# EAGLE design max10adc_v9.02_16chan_frontpanel (EAGLE 9.5.2)
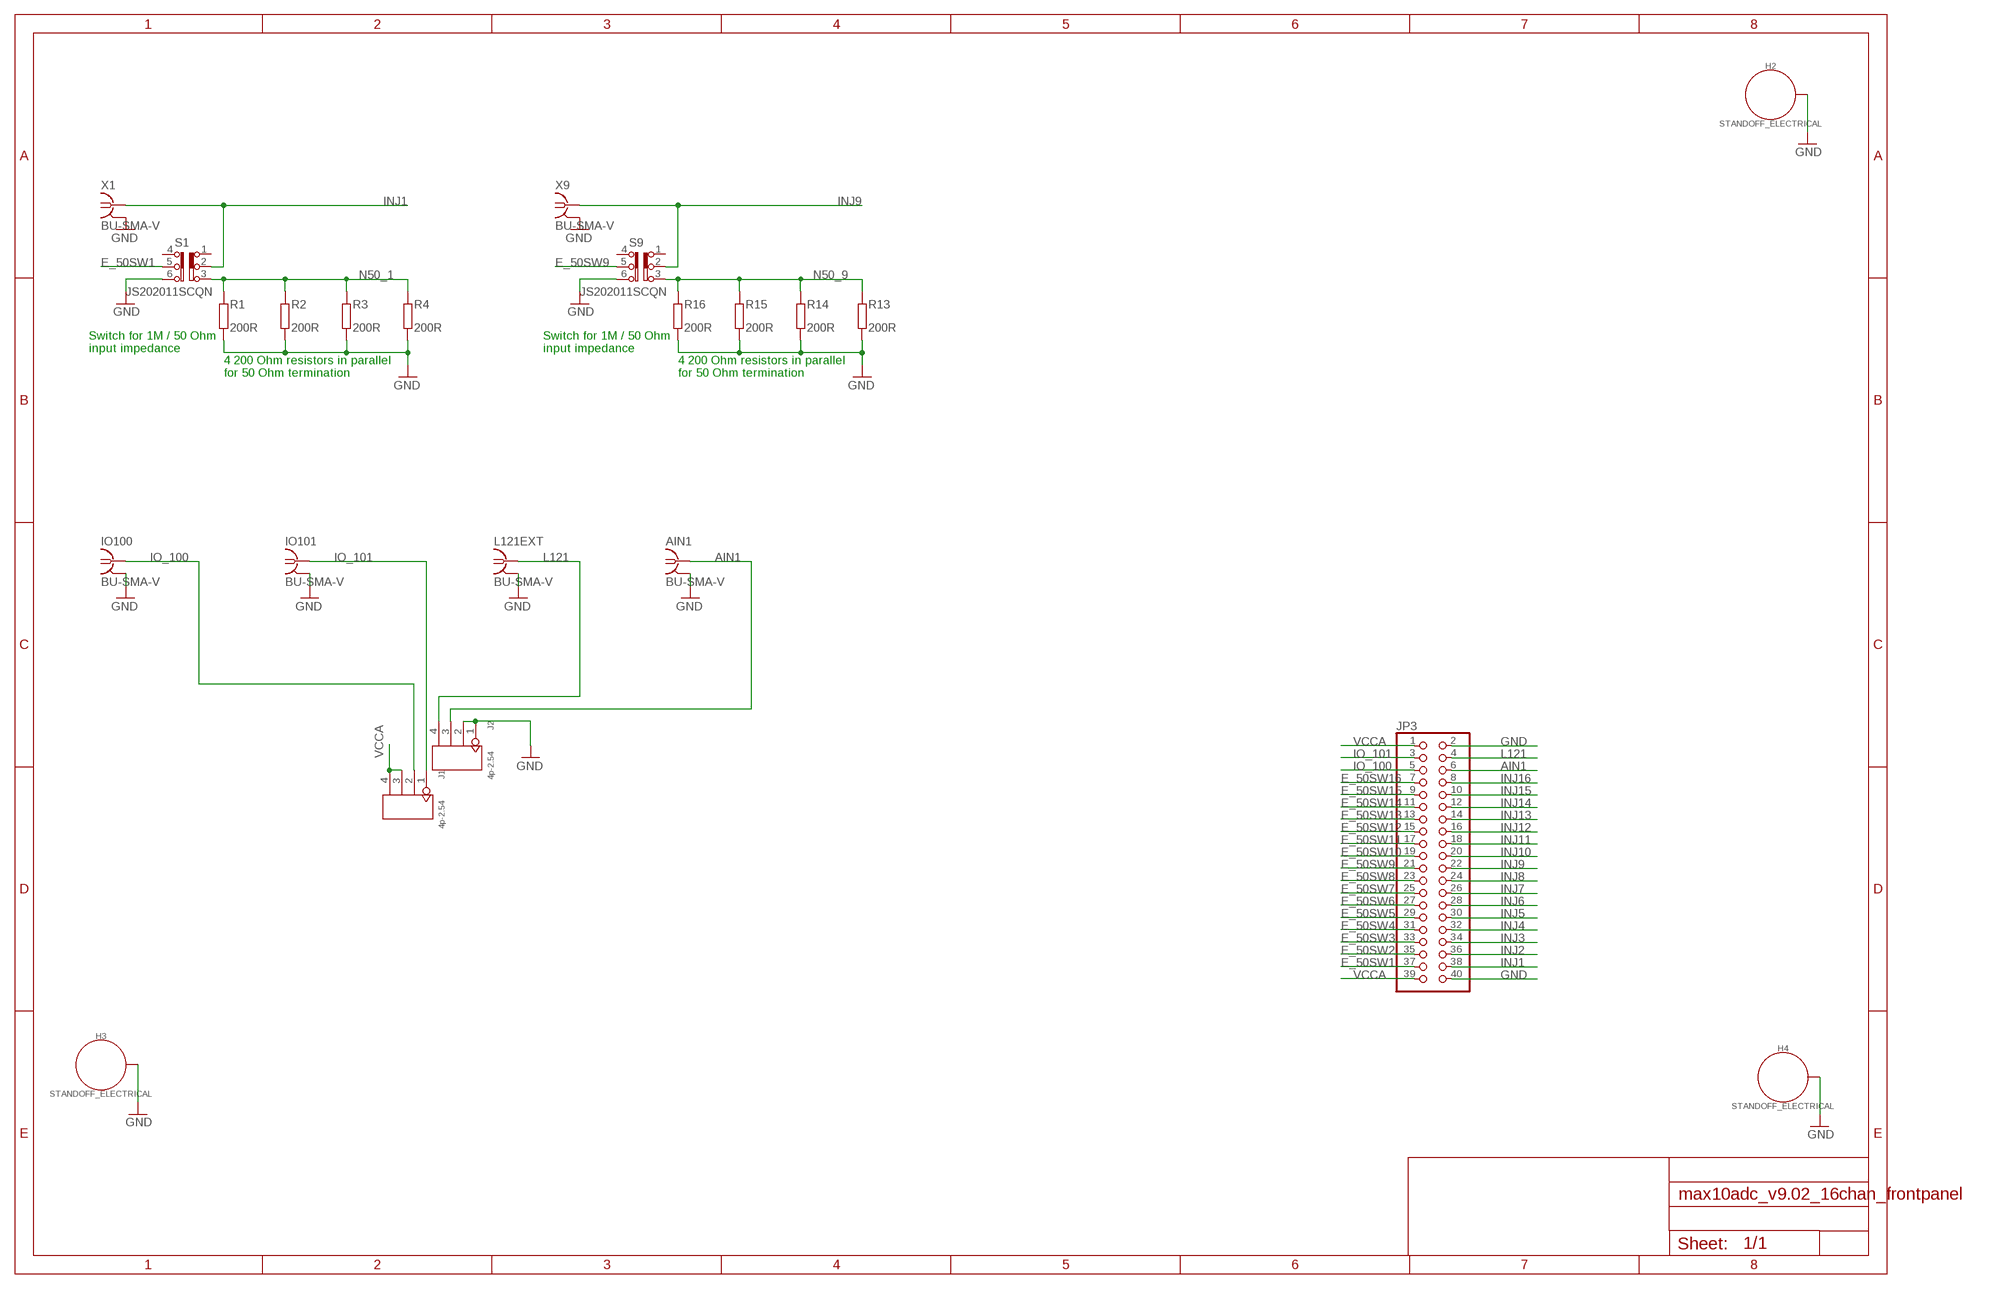
[diagram p0: schematic, sheet 1, part 1 of 2]
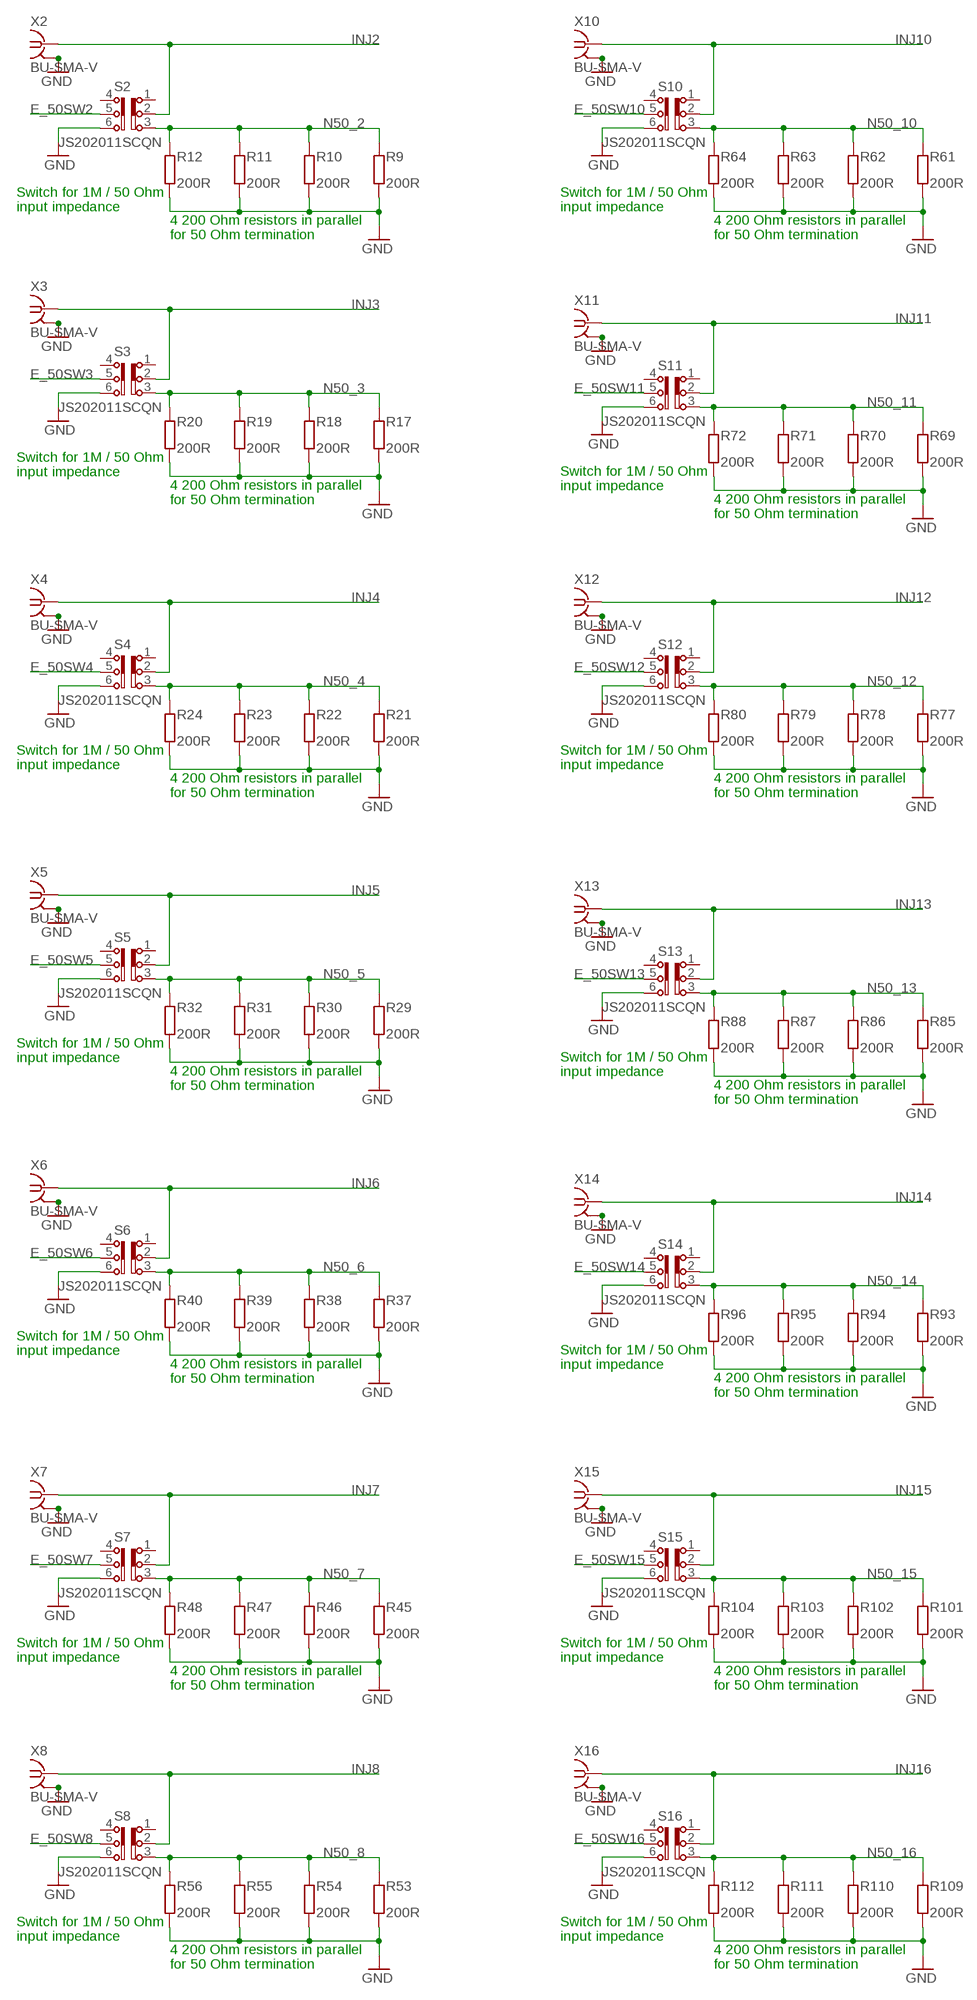
[diagram p1: schematic, sheet 1, part 2 of 2]

## Parts
AIN1  BU-SMA-V  [BU-SMA-V]
H2  STANDOFF_ELECTRICAL  [STANDOFF-ELECTRICAL]
H3  STANDOFF_ELECTRICAL  [STANDOFF-ELECTRICAL]
H4  STANDOFF_ELECTRICAL  [STANDOFF-ELECTRICAL]
IO100  BU-SMA-V  [BU-SMA-V]
IO101  BU-SMA-V  [BU-SMA-V]
J1  4p-2.54  DIP-BLACK-MALE-HEADER-VERT(4P-2.54)  [H4-2.54]
J2  4p-2.54  DIP-BLACK-MALE-HEADER-VERT(4P-2.54)  [H4-2.54]
JP3  PINHD-2X20  [2X20]
L121EXT  BU-SMA-V  [BU-SMA-V]
R1  200R  R-EU_R0805  [R0805]
R2  200R  R-EU_R0805  [R0805]
R3  200R  R-EU_R0805  [R0805]
R4  200R  R-EU_R0805  [R0805]
R9  200R  R-EU_R0805  [R0805]
R10  200R  R-EU_R0805  [R0805]
R11  200R  R-EU_R0805  [R0805]
R12  200R  R-EU_R0805  [R0805]
R13  200R  R-EU_R0805  [R0805]
R14  200R  R-EU_R0805  [R0805]
R15  200R  R-EU_R0805  [R0805]
R16  200R  R-EU_R0805  [R0805]
R17  200R  R-EU_R0805  [R0805]
R18  200R  R-EU_R0805  [R0805]
R19  200R  R-EU_R0805  [R0805]
R20  200R  R-EU_R0805  [R0805]
R21  200R  R-EU_R0805  [R0805]
R22  200R  R-EU_R0805  [R0805]
R23  200R  R-EU_R0805  [R0805]
R24  200R  R-EU_R0805  [R0805]
R29  200R  R-EU_R0805  [R0805]
R30  200R  R-EU_R0805  [R0805]
R31  200R  R-EU_R0805  [R0805]
R32  200R  R-EU_R0805  [R0805]
R37  200R  R-EU_R0805  [R0805]
R38  200R  R-EU_R0805  [R0805]
R39  200R  R-EU_R0805  [R0805]
R40  200R  R-EU_R0805  [R0805]
R45  200R  R-EU_R0805  [R0805]
R46  200R  R-EU_R0805  [R0805]
R47  200R  R-EU_R0805  [R0805]
R48  200R  R-EU_R0805  [R0805]
R53  200R  R-EU_R0805  [R0805]
R54  200R  R-EU_R0805  [R0805]
R55  200R  R-EU_R0805  [R0805]
R56  200R  R-EU_R0805  [R0805]
R61  200R  R-EU_R0805  [R0805]
R62  200R  R-EU_R0805  [R0805]
R63  200R  R-EU_R0805  [R0805]
R64  200R  R-EU_R0805  [R0805]
R69  200R  R-EU_R0805  [R0805]
R70  200R  R-EU_R0805  [R0805]
R71  200R  R-EU_R0805  [R0805]
R72  200R  R-EU_R0805  [R0805]
R77  200R  R-EU_R0805  [R0805]
R78  200R  R-EU_R0805  [R0805]
R79  200R  R-EU_R0805  [R0805]
R80  200R  R-EU_R0805  [R0805]
R85  200R  R-EU_R0805  [R0805]
R86  200R  R-EU_R0805  [R0805]
R87  200R  R-EU_R0805  [R0805]
R88  200R  R-EU_R0805  [R0805]
R93  200R  R-EU_R0805  [R0805]
R94  200R  R-EU_R0805  [R0805]
R95  200R  R-EU_R0805  [R0805]
R96  200R  R-EU_R0805  [R0805]
R101  200R  R-EU_R0805  [R0805]
R102  200R  R-EU_R0805  [R0805]
R103  200R  R-EU_R0805  [R0805]
R104  200R  R-EU_R0805  [R0805]
R109  200R  R-EU_R0805  [R0805]
R110  200R  R-EU_R0805  [R0805]
R111  200R  R-EU_R0805  [R0805]
R112  200R  R-EU_R0805  [R0805]
S1  JS202011SCQN  [JS202011SCQN]
S2  JS202011SCQN  [JS202011SCQN]
S3  JS202011SCQN  [JS202011SCQN]
S4  JS202011SCQN  [JS202011SCQN]
S5  JS202011SCQN  [JS202011SCQN]
S6  JS202011SCQN  [JS202011SCQN]
S7  JS202011SCQN  [JS202011SCQN]
S8  JS202011SCQN  [JS202011SCQN]
S9  JS202011SCQN  [JS202011SCQN]
S10  JS202011SCQN  [JS202011SCQN]
S11  JS202011SCQN  [JS202011SCQN]
S12  JS202011SCQN  [JS202011SCQN]
S13  JS202011SCQN  [JS202011SCQN]
S14  JS202011SCQN  [JS202011SCQN]
S15  JS202011SCQN  [JS202011SCQN]
S16  JS202011SCQN  [JS202011SCQN]
X1  BU-SMA-V  [BU-SMA-V]
X2  BU-SMA-V  [BU-SMA-V]
X3  BU-SMA-V  [BU-SMA-V]
X4  BU-SMA-V  [BU-SMA-V]
X5  BU-SMA-V  [BU-SMA-V]
X6  BU-SMA-V  [BU-SMA-V]
X7  BU-SMA-V  [BU-SMA-V]
X8  BU-SMA-V  [BU-SMA-V]
X9  BU-SMA-V  [BU-SMA-V]
X10  BU-SMA-V  [BU-SMA-V]
X11  BU-SMA-V  [BU-SMA-V]
X12  BU-SMA-V  [BU-SMA-V]
X13  BU-SMA-V  [BU-SMA-V]
X14  BU-SMA-V  [BU-SMA-V]
X15  BU-SMA-V  [BU-SMA-V]
X16  BU-SMA-V  [BU-SMA-V]

## Nets
AIN1: AIN1.1 J2.3 JP3.6
E_50SW1: JP3.37 S1.5
E_50SW2: JP3.35 S2.5
E_50SW3: JP3.33 S3.5
E_50SW4: JP3.31 S4.5
E_50SW5: JP3.29 S5.5
E_50SW6: JP3.27 S6.5
E_50SW7: JP3.25 S7.5
E_50SW8: JP3.23 S8.5
E_50SW9: JP3.21 S9.5
E_50SW10: JP3.19 S10.5
E_50SW11: JP3.17 S11.5
E_50SW12: JP3.15 S12.5
E_50SW13: JP3.13 S13.5
E_50SW14: JP3.11 S14.5
E_50SW15: JP3.9 S15.5
E_50SW16: JP3.7 S16.5
GND [gnd]: AIN1.2 AIN1.3 AIN1.4 AIN1.5 H2.P1 H3.P1 H4.P1 IO100.2 IO100.3 IO100.4 IO100.5 IO101.2 IO101.3 IO101.4 IO101.5 J2.1 J2.2 JP3.2 JP3.40 L121EXT.2 L121EXT.3 L121EXT.4 L121EXT.5 R1.2 R2.2 R3.2 R4.2 R9.2 R10.2 R11.2 R12.2 R13.2 R14.2 R15.2 R16.2 R17.2 R18.2 R19.2 R20.2 R21.2 R22.2 R23.2 R24.2 R29.2 R30.2 R31.2 R32.2 R37.2 R38.2 R39.2 R40.2 R45.2 R46.2 R47.2 R48.2 R53.2 R54.2 R55.2 R56.2 R61.2 R62.2 R63.2 R64.2 R69.2 R70.2 R71.2 R72.2 R77.2 R78.2 R79.2 R80.2 R85.2 R86.2 R87.2 R88.2 R93.2 R94.2 R95.2 R96.2 R101.2 R102.2 R103.2 R104.2 R109.2 R110.2 R111.2 R112.2 S1.6 S2.6 S3.6 S4.6 S5.6 S6.6 S7.6 S8.6 S9.6 S10.6 S11.6 S12.6 S13.6 S14.6 S15.6 S16.6 X1.2 X1.3 X1.4 X1.5 X2.2 X2.3 X2.4 X2.5 X3.2 X3.3 X3.4 X3.5 X4.2 X4.3 X4.4 X4.5 X5.2 X5.3 X5.4 X5.5 X6.2 X6.3 X6.4 X6.5 X7.2 X7.3 X7.4 X7.5 X8.2 X8.3 X8.4 X8.5 X9.2 X9.3 X9.4 X9.5 X10.2 X10.3 X10.4 X10.5 X11.2 X11.3 X11.4 X11.5 X12.2 X12.3 X12.4 X12.5 X13.2 X13.3 X13.4 X13.5 X14.2 X14.3 X14.4 X14.5 X15.2 X15.3 X15.4 X15.5 X16.2 X16.3 X16.4 X16.5
INJ1: JP3.38 S1.2 X1.1
INJ2: JP3.36 S2.2 X2.1
INJ3: JP3.34 S3.2 X3.1
INJ4: JP3.32 S4.2 X4.1
INJ5: JP3.30 S5.2 X5.1
INJ6: JP3.28 S6.2 X6.1
INJ7: JP3.26 S7.2 X7.1
INJ8: JP3.24 S8.2 X8.1
INJ9: JP3.22 S9.2 X9.1
INJ10: JP3.20 S10.2 X10.1
INJ11: JP3.18 S11.2 X11.1
INJ12: JP3.16 S12.2 X12.1
INJ13: JP3.14 S13.2 X13.1
INJ14: JP3.12 S14.2 X14.1
INJ15: JP3.10 S15.2 X15.1
INJ16: JP3.8 S16.2 X16.1
IO_100: IO100.1 J1.2 JP3.5
IO_101: IO101.1 J1.1 JP3.3
L121: J2.4 JP3.4 L121EXT.1
N50_1 [five]: R1.1 R2.1 R3.1 R4.1 S1.3
N50_2 [five]: R9.1 R10.1 R11.1 R12.1 S2.3
N50_3 [five]: R17.1 R18.1 R19.1 R20.1 S3.3
N50_4 [five]: R21.1 R22.1 R23.1 R24.1 S4.3
N50_5 [five]: R29.1 R30.1 R31.1 R32.1 S5.3
N50_6 [five]: R37.1 R38.1 R39.1 R40.1 S6.3
N50_7 [five]: R45.1 R46.1 R47.1 R48.1 S7.3
N50_8 [five]: R53.1 R54.1 R55.1 R56.1 S8.3
N50_9 [five]: R13.1 R14.1 R15.1 R16.1 S9.3
N50_10 [five]: R61.1 R62.1 R63.1 R64.1 S10.3
N50_11 [five]: R69.1 R70.1 R71.1 R72.1 S11.3
N50_12 [five]: R77.1 R78.1 R79.1 R80.1 S12.3
N50_13 [five]: R85.1 R86.1 R87.1 R88.1 S13.3
N50_14 [five]: R93.1 R94.1 R95.1 R96.1 S14.3
N50_15 [five]: R101.1 R102.1 R103.1 R104.1 S15.3
N50_16 [five]: R109.1 R110.1 R111.1 R112.1 S16.3
VCCA [three]: J1.3 J1.4 JP3.1 JP3.39
Unconnected: S1.1 S1.4 S2.1 S2.4 S3.1 S3.4 S4.1 S4.4 S5.1 S5.4 S6.1 S6.4 S7.1 S7.4 S8.1 S8.4 S9.1 S9.4 S10.1 S10.4 S11.1 S11.4 S12.1 S12.4 S13.1 S13.4 S14.1 S14.4 S15.1 S15.4 S16.1 S16.4

## Notes on the sheet
- Switch for 1M / 50 Ohm 
  input impedance
- Switch for 1M / 50 Ohm 
  input impedance
- 4 200 Ohm resistors in parallel
  for 50 Ohm termination
- 4 200 Ohm resistors in parallel
  for 50 Ohm termination
- Switch for 1M / 50 Ohm 
  input impedance
- Switch for 1M / 50 Ohm 
  input impedance
- 4 200 Ohm resistors in parallel
  for 50 Ohm termination
- 4 200 Ohm resistors in parallel
  for 50 Ohm termination
- Switch for 1M / 50 Ohm 
  input impedance
- Switch for 1M / 50 Ohm 
  input impedance
- 4 200 Ohm resistors in parallel
  for 50 Ohm termination
- 4 200 Ohm resistors in parallel
  for 50 Ohm termination
- Switch for 1M / 50 Ohm 
  input impedance
- Switch for 1M / 50 Ohm 
  input impedance
- 4 200 Ohm resistors in parallel
  for 50 Ohm termination
- 4 200 Ohm resistors in parallel
  for 50 Ohm termination
- Switch for 1M / 50 Ohm 
  input impedance
- Switch for 1M / 50 Ohm 
  input impedance
- 4 200 Ohm resistors in parallel
  for 50 Ohm termination
- 4 200 Ohm resistors in parallel
  for 50 Ohm termination
- Switch for 1M / 50 Ohm 
  input impedance
- Switch for 1M / 50 Ohm 
  input impedance
- 4 200 Ohm resistors in parallel
  for 50 Ohm termination
- 4 200 Ohm resistors in parallel
  for 50 Ohm termination
- Switch for 1M / 50 Ohm 
  input impedance
- Switch for 1M / 50 Ohm 
  input impedance
- 4 200 Ohm resistors in parallel
  for 50 Ohm termination
- 4 200 Ohm resistors in parallel
  for 50 Ohm termination
- Switch for 1M / 50 Ohm 
  input impedance
- Switch for 1M / 50 Ohm 
  input impedance
- 4 200 Ohm resistors in parallel
  for 50 Ohm termination
- 4 200 Ohm resistors in parallel
  for 50 Ohm termination

## Library data of the parts
AIN1 IO100 IO101 L121EXT X1-X16 = con-coax_haas:BU-SMA-V: FEMALE SMA CONNECTOR Radiall distributor RS 112-3794; OC_FARNELL: unknown; OC_NEWARK: unknown
H2-H4 = SparkFun-Hardware:STANDOFF_ELECTRICAL: Stand Off Drill holes with an electrical connection. For example, use these to ground your board to a chassis. Example SparkFun Products Screw - Phillips Head (1/4", 4-40, 10 pack) <https://www.sparkfun.com/products/10453> (PRT-10453) Screw - Phillips Head (1/2", 4-40, 10 pack) <https://www.sparkfun.com/products/10452> (PRT-10452) Screw - Phillips Head (3/4", 4-40, 10 pack) <https://www.sparkfun.com/products/10451> (PRT-10451) Screw - Phillips Head (1", 4-40, 10 pack) <https://www.sparkfun.com/products/10450> (PRT-10450)
J1 J2 = Seeed-Connector:DIP-BLACK-MALE-HEADER-VERT(4P-2.54): 320020017; MPN: P125-1104A0BS116A1
JP3 = pinhead:PINHD-2X20: PIN HEADER
R1-R4 R9-R24 R29-R32 R37-R40 R45-R48 R53-R56 R61-R64 R69-R72 R77-R80 R85-R88 R93-R96 R101-R104 R109-R112 = resistor:R-EU_: RESISTOR, European symbol
S1-S16 = switch-ck:JS202011SCQN: DPDT SLIDE SWITCH

## Net classes
0 default: width 0.152 mm
1 gnd: width 0.305 mm
2 three: width 0.305 mm
3 five: width 0.381 mm

## Board
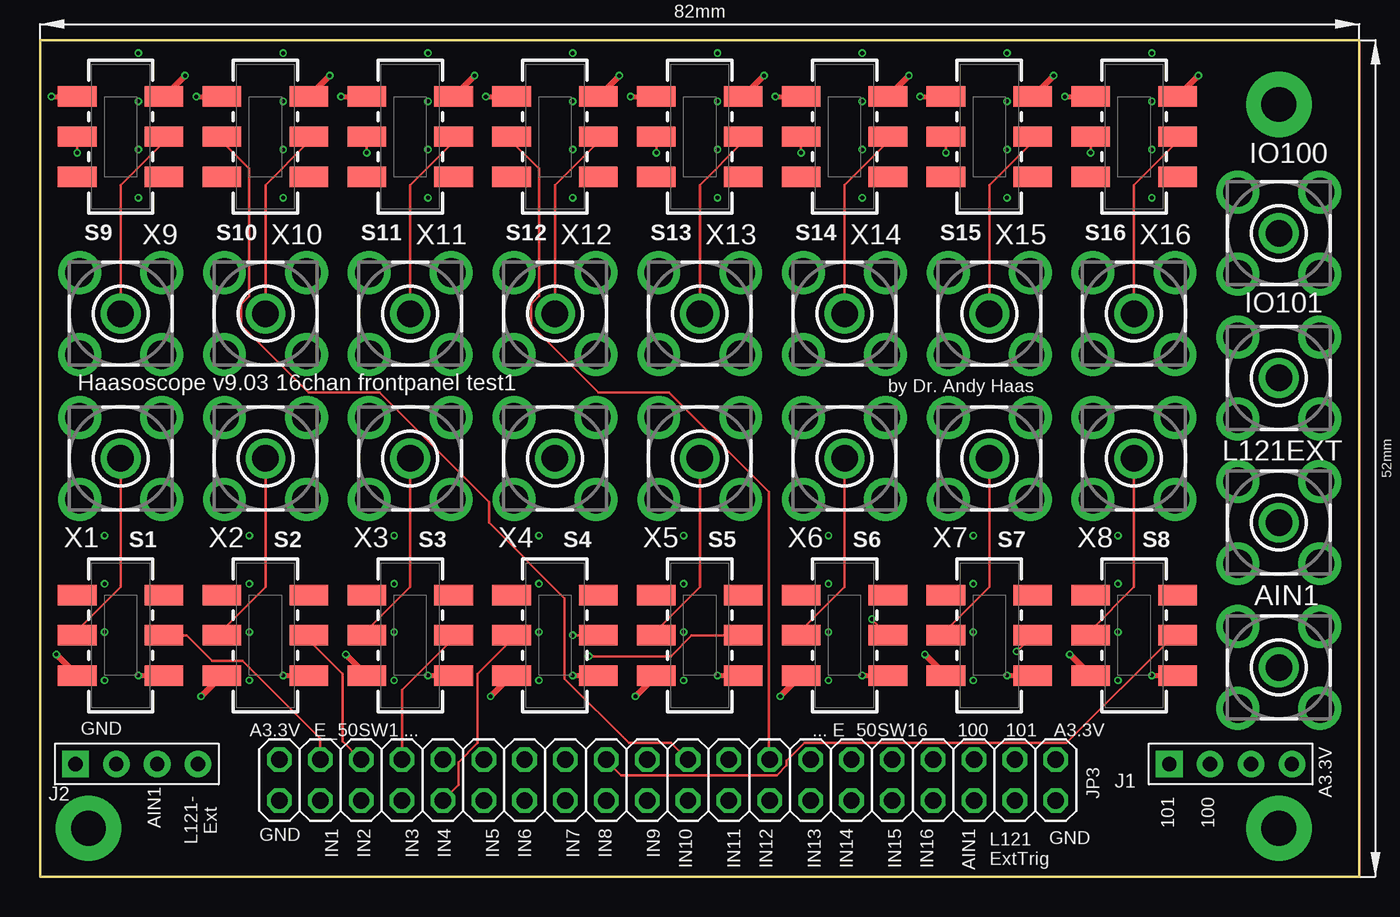
[diagram p2: board, top side]
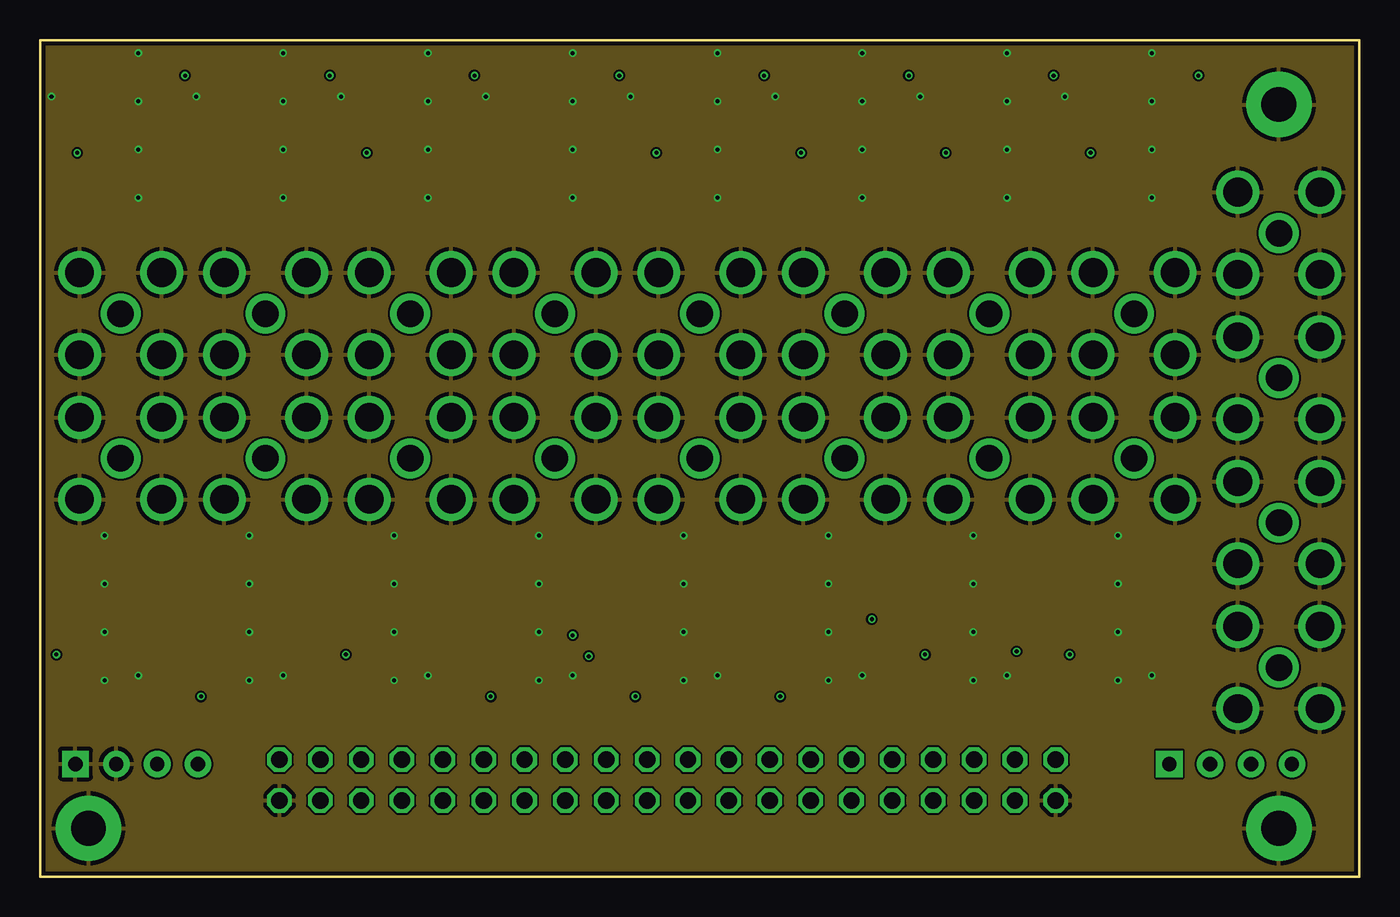
[diagram p3: board, inner layer Route2]
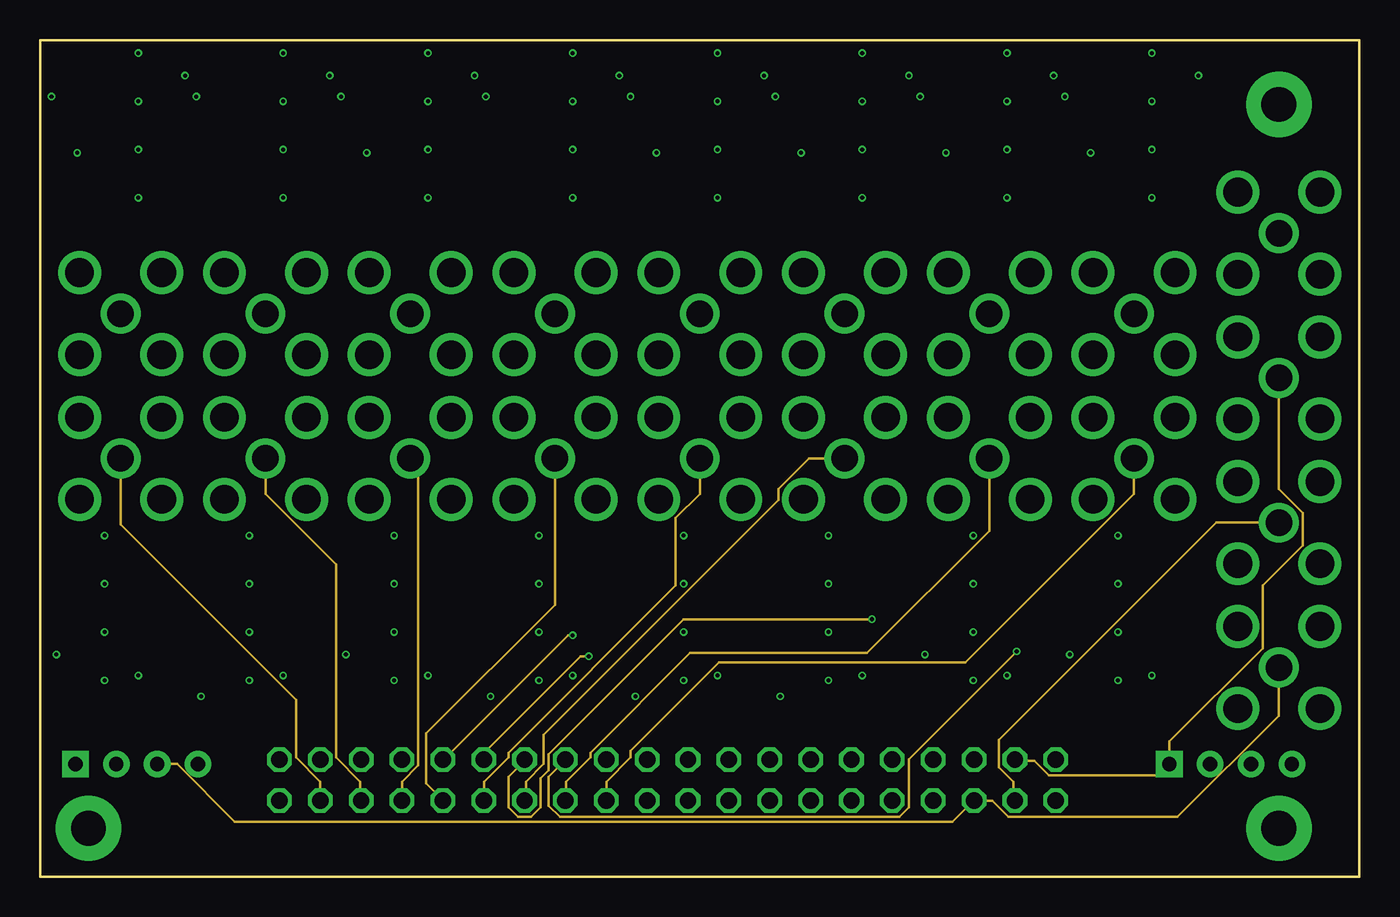
[diagram p4: board, inner layer Route15]
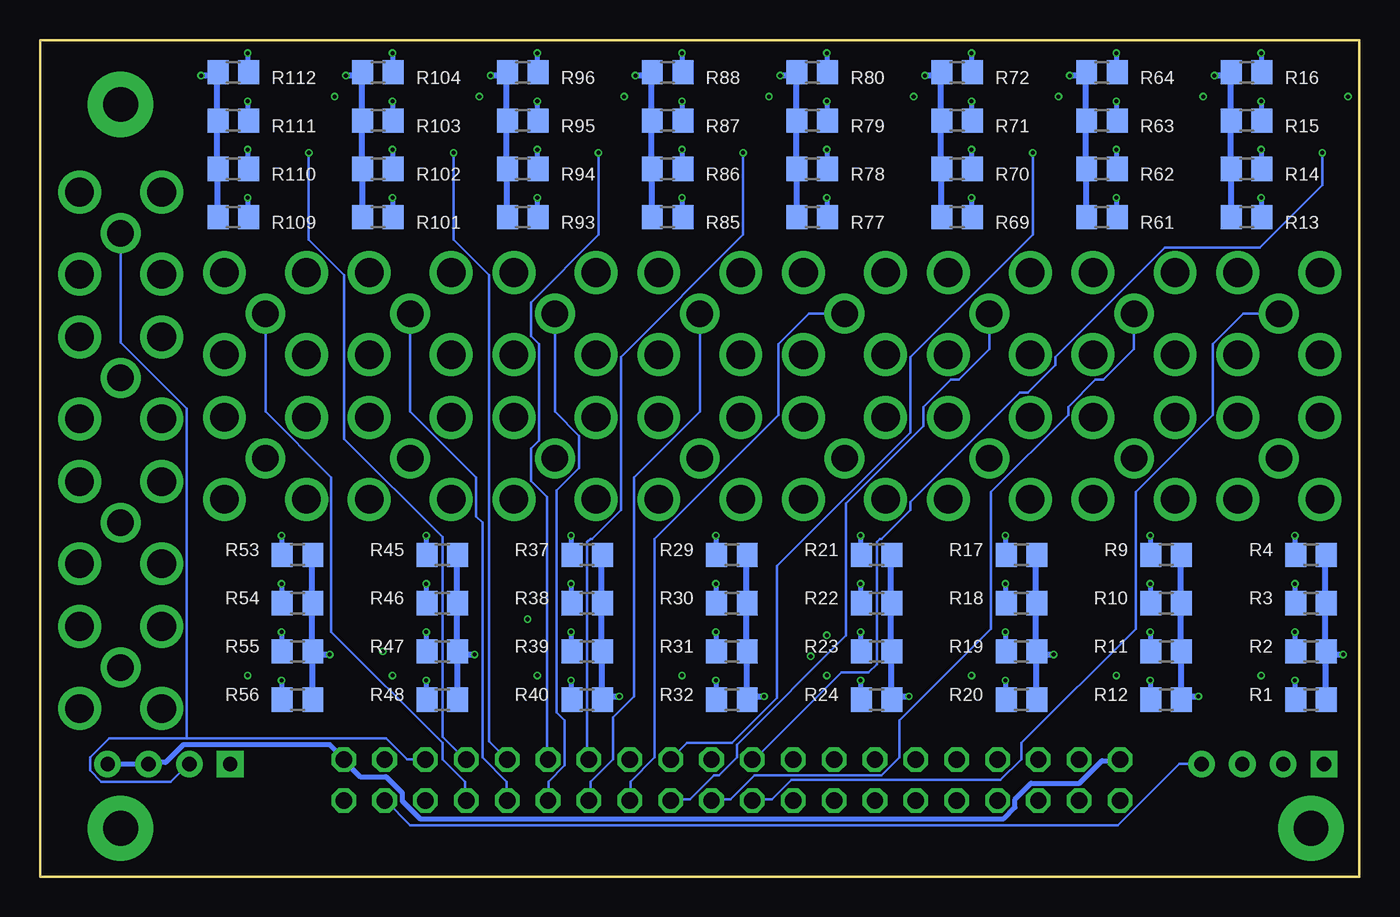
[diagram p5: board, bottom side, seen from below]

Size 82 x 52 mm. Coordinates in mm from the lower left corner, seen from the top.
Outline: 0,52 82,52 82,0 0,0 0,52
Copper layers (1*2*15*16): Top 0.035mm / dielectric 0.23mm / Route2 0.035mm / dielectric 0.93mm / Route15 0.035mm / dielectric 0.23mm / Bottom 0.035mm
Design rules "MF_Standard_4_Layer": minimum track width 5mil, minimum drill 10mil, track to track 5mil, track to pad 5mil, pad to pad 5mil, via to via 5mil, smd to smd 0mil, copper to edge 10mil, drill to drill 10mil, minimum pad ring 4mil, minimum via ring 4mil, stop-mask expansion 2mil, vias tented up to drill 25mil, thermal gap 10mil

### Footprints (pad centres in the part's own frame; a part is rotated, then mirrored left to right if it is on the bottom)
BU-SMA-V = drill 1.651: 1 0,0 | drill 1.778: 2 -2.55,2.55; 3 2.55,2.55; 4 2.55,-2.55; 5 -2.55,-2.55
STANDOFF-ELECTRICAL = drill 2.159 pad 4.064: P1 0,0
H4-2.54 = drill 0.889 pad 1.651 square: 1 0,3.81 | drill 0.889 pad 1.651: 2 0,1.27; 3 0,-1.27; 4 0,-3.81
2X20 = drill 1.016 octagon: 1 -24.13,-1.27; 2 -24.13,1.27; 3 -21.59,-1.27; 4 -21.59,1.27; 5 -19.05,-1.27; 6 -19.05,1.27; 7 -16.51,-1.27; 8 -16.51,1.27; 9 -13.97,-1.27; 10 -13.97,1.27; 11 -11.43,-1.27; 12 -11.43,1.27; 13 -8.89,-1.27; 14 -8.89,1.27; 15 -6.35,-1.27; 16 -6.35,1.27; 17 -3.81,-1.27; 18 -3.81,1.27; 19 -1.27,-1.27; 20 -1.27,1.27; 21 1.27,-1.27; 22 1.27,1.27; 23 3.81,-1.27; 24 3.81,1.27; 25 6.35,-1.27; 26 6.35,1.27; 27 8.89,-1.27; 28 8.89,1.27; 29 11.43,-1.27; 30 11.43,1.27; 31 13.97,-1.27; 32 13.97,1.27; 33 16.51,-1.27; 34 16.51,1.27; 35 19.05,-1.27; 36 19.05,1.27; 37 21.59,-1.27; 38 21.59,1.27; 39 24.13,-1.27; 40 24.13,1.27
R0805 = smd 1.3 x 1.5: 1 -0.95,0; 2 0.95,0
JS202011SCQN = smd 1.27 x 2.4: 1 -2.5,-2.7; 2 0,-2.7; 3 2.5,-2.7; 4 -2.5,2.7; 5 0,2.7; 6 2.5,2.7

### Placement (x,y rotation side)
AIN1  77,13 0 top
H2  77,48 270 top
H3  3,3 0 top
H4  77,3 0 top
IO100  77,40 0 top
IO101  77,31 0 top
J1  74,7 90 top
J2  6,7 90 top
JP3  39,6 180 top
L121EXT  77,22 0 top
R1  3,11 180 bottom
R2  3,14 180 bottom
R3  3,17 180 bottom
R4  3,20 180 bottom
R9  12,20 180 bottom
R10  12,17 180 bottom
R11  12,14 180 bottom
R12  12,11 180 bottom
R13  7,41 0 bottom
R14  7,44 0 bottom
R15  7,47 0 bottom
R16  7,50 0 bottom
R17  21,20 180 bottom
R18  21,17 180 bottom
R19  21,14 180 bottom
R20  21,11 180 bottom
R21  30,20 180 bottom
R22  30,17 180 bottom
R23  30,14 180 bottom
R24  30,11 180 bottom
R29  39,20 180 bottom
R30  39,17 180 bottom
R31  39,14 180 bottom
R32  39,11 180 bottom
R37  48,20 180 bottom
R38  48,17 180 bottom
R39  48,14 180 bottom
R40  48,11 180 bottom
R45  57,20 180 bottom
R46  57,17 180 bottom
R47  57,14 180 bottom
R48  57,11 180 bottom
R53  66,20 180 bottom
R54  66,17 180 bottom
R55  66,14 180 bottom
R56  66,11 180 bottom
R61  16,41 0 bottom
R62  16,44 0 bottom
R63  16,47 0 bottom
R64  16,50 0 bottom
R69  25,41 0 bottom
R70  25,44 0 bottom
R71  25,47 0 bottom
R72  25,50 0 bottom
R77  34,41 0 bottom
R78  34,44 0 bottom
R79  34,47 0 bottom
R80  34,50 0 bottom
R85  43,41 0 bottom
R86  43,44 0 bottom
R87  43,47 0 bottom
R88  43,50 0 bottom
R93  52,41 0 bottom
R94  52,44 0 bottom
R95  52,47 0 bottom
R96  52,50 0 bottom
R101  61,41 0 bottom
R102  61,44 0 bottom
R103  61,47 0 bottom
R104  61,50 0 bottom
R109  70,41 0 bottom
R110  70,44 0 bottom
R111  70,47 0 bottom
R112  70,50 0 bottom
S1  5,15 270 top
S2  14,15 270 top
S3  23,15 270 top
S4  32,15 270 top
S5  41,15 270 top
S6  50,15 270 top
S7  59,15 270 top
S8  68,15 270 top
S9  5,46 90 top
S10  14,46 90 top
S11  23,46 90 top
S12  32,46 90 top
S13  41,46 90 top
S14  50,46 90 top
S15  59,46 90 top
S16  68,46 90 top
X1  5,26 0 top
X2  14,26 0 top
X3  23,26 0 top
X4  32,26 0 top
X5  41,26 0 top
X6  50,26 0 top
X7  59,26 0 top
X8  68,26 0 top
X9  5,35 180 top
X10  14,35 180 top
X11  23,35 180 top
X12  32,35 180 top
X13  41,35 180 top
X14  50,35 180 top
X15  59,35 180 top
X16  68,35 180 top

### Tracks (layer width: path | path; a pad name or v marks a point on that pad's centre or on a via)
AIN1
  Route15 0.152: AIN1.1 77,10 70.7,3.7 60.2,3.7 59.2,4.7 58.1,4.7 JP3.6 58,4.7 56.7,3.4 12.1,3.4 8.5,7 J2.3
E_50SW1
  Top 0.152: S1.5 9.1,15 10.7,13.4 12.6,13.4 17.4,8.6 17.4,7.3 JP3.37
E_50SW2
  Top 0.152: S2.5 16.7,14.7 18.8,12.6 18.8,8.4 19.9,7.3 JP3.35
E_50SW3
  Top 0.152: S3.5 25.7,14.8 22.5,11.6 22.5,7.3 JP3.33
E_50SW4  (via drill 0.25)
  Top 0.152: v33.1,15 S4.5
  Route15 0.152: v33.1,15 32.8,15 25.1,7.3 JP3.31
E_50SW5  (via drill 0.25)
  Top 0.152: S5.5 40.5,15 39.2,13.7 v34.1,13.7
  Route15 0.152: v34.1,13.7 33.6,13.7 27.6,7.7 27.6,7.3 JP3.29
E_50SW6  (via drill 0.25)
  Top 0.152: v51.7,16 S6.5
  Route15 0.152: v51.7,16 40,16 31.6,7.6 31.6,6.6 31.1,6.1 31.1,4.3 30.5,3.7 29.7,3.7 29.1,4.3 29.1,6.2 30.1,7.2 JP3.27
E_50SW7  (via drill 0.25)
  Top 0.152: v60.7,14 S7.5
  Route15 0.152: v60.7,14 54,7.3 54,4.3 53.4,3.7 32.3,3.7 31.6,4.4 31.6,6.2 32.6,7.2 JP3.25
E_50SW8
  Top 0.152: S8.5 70.5,15 63.8,8.3 47.5,8.3 46.4,7.2 46.4,6.9 45.8,6.3 36.1,6.3 35.2,7.2 JP3.23
E_50SW9  (via drill 0.25)
  Top 0.152: v2.3,45 S9.5
  Bottom 0.152: v2.3,45 2.3,43 6.2,39.1 12.1,39.1 18.9,32.3 18.9,31.8 20.6,30.1 21.1,30.1 27.9,23.3 27.9,22.8 29.7,21 29.8,21 30,20.8 30,13.2 30.5,12.7 32.2,12.7 37.7,7.2 JP3.21
E_50SW10
  Top 0.152: S10.5 11.3,45.7 13,44 13,36.1 12.5,35.6 12.5,34.3 16.7,30.1 21.1,30.1 27.9,23.3 27.9,22 32.6,17.3 32.6,12.3 36.6,8.3 39.2,8.3 40.2,7.3 JP3.19
E_50SW11  (via drill 0.25)
  Top 0.152: v20.3,45 S11.5
  Bottom 0.152: v20.3,45 20.3,39.9 27.9,32.3 27.9,27.6 36.2,19.3 36.2,11.1 39,8.3 41.8,8.3 42.8,7.3 JP3.17
E_50SW12
  Top 0.152: S12.5 29.3,45.7 31,44 31,36.1 30.5,35.6 30.5,34.3 34.7,30.1 39.1,30.1 45.3,23.9 45.3,7.3 JP3.15
E_50SW13  (via drill 0.25)
  Top 0.152: v38.3,45 S13.5
  Bottom 0.152: v38.3,45 38.3,39.9 45.9,32.3 45.9,22.8 47.7,21 47.8,21 48,20.8 48,7.4 47.9,7.3 JP3.13
E_50SW14  (via drill 0.25)
  Top 0.152: v47.3,45 S14.5
  Bottom 0.152: v47.3,45 47.3,39.9 51.5,35.7 51.5,33.6 51,33.1 51,27.1 51.5,26.6 51.5,24.6 50.5,23.6 50.5,7.3 JP3.11
E_50SW15  (via drill 0.25)
  Top 0.152: v56.3,45 S15.5
  Bottom 0.152: v56.3,45 56.3,39.6 54.1,37.4 54.1,8.4 JP3.9
E_50SW16  (via drill 0.25)
  Top 0.152: v65.3,45 S16.5
  Bottom 0.152: v65.3,45 65.3,39.6 63.1,37.4 63.1,27.2 57,21.1 57,8.7 55.6,7.3 JP3.7
GND  (via drill 0.25)
  Top 0.305: v6.1,12.5 S1.6 | v15.1,12.5 S2.6 | v24.1,12.5 S3.6 | v33.1,12.5 S4.6 | v0.7,48.5 S9.6 | v42.1,12.5 S5.6 | v9.7,48.5 S10.6 | v51.1,12.5 S6.6 | v18.7,48.5 S11.6 | v60.1,12.5 S7.6 | v27.7,48.5 S12.6 | v69.1,12.5 S8.6 | v36.7,48.5 S13.6 | v45.7,48.5 S14.6 | v54.7,48.5 S15.6 | v63.7,48.5 S16.6
  Bottom 0.305: v4,12.2 4,11 R1.2 | v4,15.2 4,14 R2.2 | v4,18.2 4,17 R3.2 | v4,21.2 4,20 R4.2 | v13,12.2 13,11 R12.2 | v13,15.2 13,14 R11.2 | v13,18.2 13,17 R10.2 | v22,12.2 22,11 R20.2 | v13,21.2 13,20 R9.2 | v22,15.2 22,14 R19.2 | v22,18.2 22,17 R18.2 | v22,21.2 22,20 R17.2 | v31,12.2 31,11 R24.2 | v31,15.2 31,14 R23.2 | v31,18.2 31,17 R22.2 | v6.1,42.2 6.1,41 R13.2 | v40,12.2 40,11 R32.2 | v31,21.2 31,20 R21.2 | v6.1,45.2 6.1,44 R14.2 | v40,15.2 40,14 R31.2 | v6.1,48.2 6.1,47 R15.2 | v15.1,42.2 15.1,41 R61.2 | v40,18.2 40,17 R30.2 | v6.1,51.2 6.1,50 R16.2 | v15.1,45.2 15.1,44 R62.2 | v40,21.2 40,20 R29.2 | v15.1,48.2 15.1,47 R63.2 | v49,12.2 49,11 R40.2 | v15.1,51.2 15.1,50 R64.2 | v49,15.2 49,14 R39.2 | v24.1,42.2 24.1,41 R69.2 | v49,18.2 49,17 R38.2 | v24.1,45.2 24.1,44 R70.2 | v58,12.2 58,11 R48.2 | v49,21.2 49,20 R37.2 | v24.1,48.2 24.1,47 R71.2 | v58,15.2 58,14 R47.2 | v24.1,51.2 24.1,50 R72.2 | v58,18.2 58,17 R46.2 | v33.1,42.2 33.1,41 R77.2 | v58,21.2 58,20 R45.2 | v33.1,45.2 33.1,44 R78.2 | v67,12.2 67,11 R56.2 | v33.1,48.2 33.1,47 R79.2 | v67,15.2 67,14 R55.2 | v42.1,42.2 42.1,41 R85.2 | v33.1,51.2 33.1,50 R80.2 | v67,18.2 67,17 R54.2 | v42.1,45.2 42.1,44 R86.2 | v67,21.2 67,20 R53.2 | v42.1,48.2 42.1,47 R87.2 | v42.1,51.2 42.1,50 R88.2 | v51.1,42.2 51.1,41 R93.2 | v51.1,45.2 51.1,44 R94.2 | v51.1,48.2 51.1,47 R95.2 | v60.1,42.2 60.1,41 R101.2 | v51.1,51.2 51.1,50 R96.2 | v60.1,45.2 60.1,44 R102.2 | v60.1,48.2 60.1,47 R103.2 | v60.1,51.2 60.1,50 R104.2 | v69.1,42.2 69.1,41 R109.2 | v69.1,45.2 69.1,44 R110.2 | v69.1,48.2 69.1,47 R111.2 | v69.1,51.2 69.1,50 R112.2
  pour Route2: -2,57 86,57 86,-3 -3,-3 -3,56
INJ1
  Top 0.152: S1.2 2.3,15.3 5,18 X1.1
  Route15 0.152: X1.1 5,21.9 15.9,11 15.9,7.4 17.4,5.9 17.4,4.8 JP3.38
INJ2
  Top 0.152: S2.2 11.3,15.3 14,18 X2.1
  Route15 0.152: X2.1 14,23.8 18.4,19.4 18.4,7.4 19.9,5.9 19.9,4.8 JP3.36
INJ3
  Top 0.152: S3.2 20.3,15.3 23,18 X3.1
  Route15 0.152: X3.1 23.5,25.5 23.5,6.9 22.5,5.9 22.5,4.8 JP3.34
INJ4
  Top 0.152: S4.2 29.3,14.7 27.2,12.6 27.2,8.3 26,7.1 26,5.7 JP3.32
  Route15 0.152: X4.1 32,16.9 24,8.9 24,5.8 25,4.8 JP3.32
INJ5
  Top 0.152: S5.2 38.3,15.3 41,18 X5.1
  Route15 0.152: X5.1 41,23.8 39.5,22.3 39.5,18.1 29.1,7.7 29.1,7.4 27.6,5.9 27.6,4.8 JP3.30
INJ6
  Top 0.152: S6.2 47.3,15.3 50,18 X6.1
  Route15 0.152: X6.1 47.8,26 45.9,24.1 45.9,23.4 31.3,8.8 31.3,7 30.2,5.9 30.2,4.8 JP3.28
INJ7
  Top 0.152: S7.2 56.3,15.3 59,18 X7.1
  Route15 0.152: X7.1 59,21.5 51.4,13.9 40.4,13.9 34.2,7.7 34.2,7.4 32.7,5.9 32.7,4.8 JP3.26
INJ8
  Top 0.152: S8.2 65.3,15.3 68,18 X8.1
  Route15 0.152: X8.1 68,23.8 57.5,13.3 42.2,13.3 36.7,7.8 36.7,7.4 35.2,5.9 35.2,4.8 JP3.24
INJ9
  Top 0.152: S9.2 7.7,45.7 5,43 X9.1
  Bottom 0.152: X9.1 7.2,35 9.1,33.1 9.1,28.7 13.9,23.9 13.9,15.4 21,8.3 21,7.3 22.3,6 35.3,6 36.5,4.8 37.7,4.8 JP3.22
INJ10
  Top 0.152: S10.2 16.7,45.7 14,43 X10.1
  Bottom 0.152: X10.1 14,32.8 15.9,30.9 16.4,30.9 18.1,29.2 18.1,28.7 22.9,23.9 22.9,15.4 28.6,9.7 28.6,7.4 29.7,6.3 37.6,6.3 39.1,4.8 40.2,4.8 JP3.20
INJ11
  Top 0.152: S11.2 25.7,45.7 23,43 X11.1
  Bottom 0.152: X11.1 23,32.8 24.9,30.9 25.4,30.9 27.1,29.2 27.1,28 31.9,23.2 31.9,15 38.7,8.2 38.7,7.4 39.8,6.3 40.1,6.3 41.6,4.8 42.8,4.8 JP3.18
INJ12
  Top 0.152: S12.2 34.7,45.7 32,43 X12.1
  Bottom 0.152: X12.1 34.2,35 36.1,33.1 36.1,28.7 43.8,21 43.8,7.4 45.3,5.9 45.3,4.8 JP3.16
INJ13
  Top 0.152: S13.2 43.7,45.7 41,43 X13.1
  Bottom 0.152: X13.1 41,28.9 45.1,24.8 45.1,11.2 46.4,9.9 46.4,7.3 47.8,5.9 47.8,4.8 JP3.14
INJ14
  Top 0.152: S14.2 52.7,45.7 50,43 X14.1
  Bottom 0.152: X14.1 50,28.9 48.5,27.4 48.5,25.4 49.9,24 49.9,10.2 49.4,9.7 49.4,6.9 50.4,5.9 50.4,4.8 JP3.12
INJ15
  Top 0.152: S15.2 61.7,45.7 59,43 X15.1
  Bottom 0.152: X15.1 59,28.9 54.9,24.8 54.9,22.4 54.5,22 54.5,7.4 53,5.9 53,4.8 JP3.10
INJ16
  Top 0.152: S16.2 70.7,45.7 68,43 X16.1
  Bottom 0.152: X16.1 68,28.9 63.9,24.8 63.9,15.2 57,8.3 57,7.3 55.6,5.9 55.6,4.8 JP3.8
IO_100
  Bottom 0.152: 72.9,8.6 77.7,8.6 78.9,7.4 78.9,6.6 78.2,5.9 73.9,5.9 72.8,7 J1.2 | 72.9,8.6 60.5,8.6 59.2,7.3 58.1,7.3 JP3.5 | IO100.1 77,33.2 72.9,29.1 72.9,8.6
IO_101
  Route15 0.152: JP3.3 60.6,7.2 61.8,7.2 62.7,6.3 69.4,6.3 70.1,7 J1.1 70.2,8.4 76,14.2 76,18.1 78.5,20.6 78.5,22.6 77,24.1 IO101.1
L121
  Route15 0.152: L121EXT.1 73.1,22 59.6,8.5 59.6,6.8 60.5,5.9 60.5,4.8 JP3.4
  Bottom 0.152: J2.4 11.2,7 15,3.2 59,3.2 60.5,4.7 JP3.4
N50_1  (via drill 0.25)
  Top 0.381: v1,13.8 S1.3
  Bottom 0.381: R1.1 2.1,11 2.1,14 R2.1 | R2.1 2.1,14.1 2.1,17 R3.1 2.1,17.1 2.1,20 R4.1 | v1,13.8 2,13.8 R2.1
N50_2  (via drill 0.25)
  Top 0.381: v10,11.2 S2.3
  Bottom 0.381: R9.1 11.1,20 11.1,17.1 R10.1 11.1,17 11.1,14.1 R11.1 11.1,14 11.1,11 R12.1 11,11.2 v10,11.2
N50_3  (via drill 0.25)
  Top 0.381: v19,13.8 S3.3
  Bottom 0.381: R20.1 20.1,11 20.1,14 R19.1 | R19.1 20.1,14.1 20.1,17 R18.1 20.1,17.1 20.1,20 R17.1 | v19,13.8 20,13.8 R19.1
N50_4  (via drill 0.25)
  Top 0.381: v28,11.2 S4.3
  Bottom 0.381: R21.1 29.1,20 29.1,17.1 R22.1 29.1,17 29.1,14.1 R23.1 29.1,14 29.1,11 R24.1 29,11.2 v28,11.2
N50_5  (via drill 0.25)
  Top 0.381: v37,11.2 S5.3
  Bottom 0.381: R29.1 38.1,20 38.1,17.1 R30.1 38.1,17 38.1,14.1 R31.1 38.1,14 38.1,11 R32.1 38,11.2 v37,11.2
N50_6  (via drill 0.25)
  Top 0.381: v46,11.2 S6.3
  Bottom 0.381: R37.1 47.1,20 47.1,17.1 R38.1 47.1,17 47.1,14.1 R39.1 47.1,14 47.1,11 R40.1 47,11.2 v46,11.2
N50_7  (via drill 0.25)
  Top 0.381: v55,13.8 S7.3
  Bottom 0.381: R48.1 56.1,11 56.1,14 R47.1 | R47.1 56.1,14.1 56.1,17 R46.1 56.1,17.1 56.1,20 R45.1 | v55,13.8 56,13.8 R47.1
N50_8  (via drill 0.25)
  Top 0.381: v64,13.8 S8.3
  Bottom 0.381: R56.1 65.1,11 65.1,14 R55.1 | R55.1 65.1,14.1 65.1,17 R54.1 65.1,17.1 65.1,20 R53.1 | v64,13.8 65,13.8 R55.1
N50_9  (via drill 0.25)
  Top 0.381: v9,49.8 S9.3
  Bottom 0.381: R13.1 8,41 8,44 R14.1 8,44.1 8,47 R15.1 8,47.1 8,50 R16.1 8.1,49.8 v9,49.8
N50_10  (via drill 0.25)
  Top 0.381: v18,49.8 S10.3
  Bottom 0.381: R61.1 17,41 17,44 R62.1 17,44.1 17,47 R63.1 17,47.1 17,50 R64.1 17.1,49.8 v18,49.8
N50_11  (via drill 0.25)
  Top 0.381: v27,49.8 S11.3
  Bottom 0.381: R69.1 26,41 26,44 R70.1 26,44.1 26,47 R71.1 26,47.1 26,50 R72.1 26.1,49.8 v27,49.8
N50_12  (via drill 0.25)
  Top 0.381: v36,49.8 S12.3
  Bottom 0.381: R77.1 35,41 35,44 R78.1 35,44.1 35,47 R79.1 35,47.1 35,50 R80.1 35.1,49.8 v36,49.8
N50_13  (via drill 0.25)
  Top 0.381: v45,49.8 S13.3
  Bottom 0.381: R85.1 44,41 44,44 R86.1 44,44.1 44,47 R87.1 44,47.1 44,50 R88.1 44.1,49.8 v45,49.8
N50_14  (via drill 0.25)
  Top 0.381: v54,49.8 S14.3
  Bottom 0.381: R93.1 53,41 53,44 R94.1 53,44.1 53,47 R95.1 53,47.1 53,50 R96.1 53.1,49.8 v54,49.8
N50_15  (via drill 0.25)
  Top 0.381: v63,49.8 S15.3
  Bottom 0.381: R101.1 62,41 62,44 R102.1 62,44.1 62,47 R103.1 62,47.1 62,50 R104.1 62.1,49.8 v63,49.8
N50_16  (via drill 0.25)
  Top 0.381: v72,49.8 S16.3
  Bottom 0.381: R109.1 71,41 71,44 R110.1 71,44.1 71,47 R111.1 71,47.1 71,50 R112.1 71.1,49.8 v72,49.8
VCCA
  Bottom 0.305: J1.4 J1.3 75.2,7.1 74.2,7.1 73.1,8.2 64,8.2 63.2,7.4 JP3.1 63.1,7.2 62.1,6.2 60.5,6.2 59.5,5.2 59.5,4.7 58.4,3.6 22.1,3.6 21.4,4.3 21.4,4.8 20.4,5.8 17.4,5.8 16,7.2 14.9,7.2 JP3.39

### Text on the board
tPlace: Haasoscope v9.03 16chan frontpanel test1 | by Dr. Andy Haas | GND | A3.3V | E_50SW1 ... | ... E_50SW16 | 100 | 101 | A3.3V | A3.3V | AIN1 | IN1 | IN2 | IN3 | IN4 | IN5 | IN6 | IN7 | IN8 | IN9 | IN10 | IN11 | IN12 | IN13 | IN14 | IN15 | IN16 | AIN1 | 101 | 100 | L121- / Ext | GND | GND | L121 / ExtTrig